# Altium project VoodooMagic.PrjPcb (part 1 of 2)
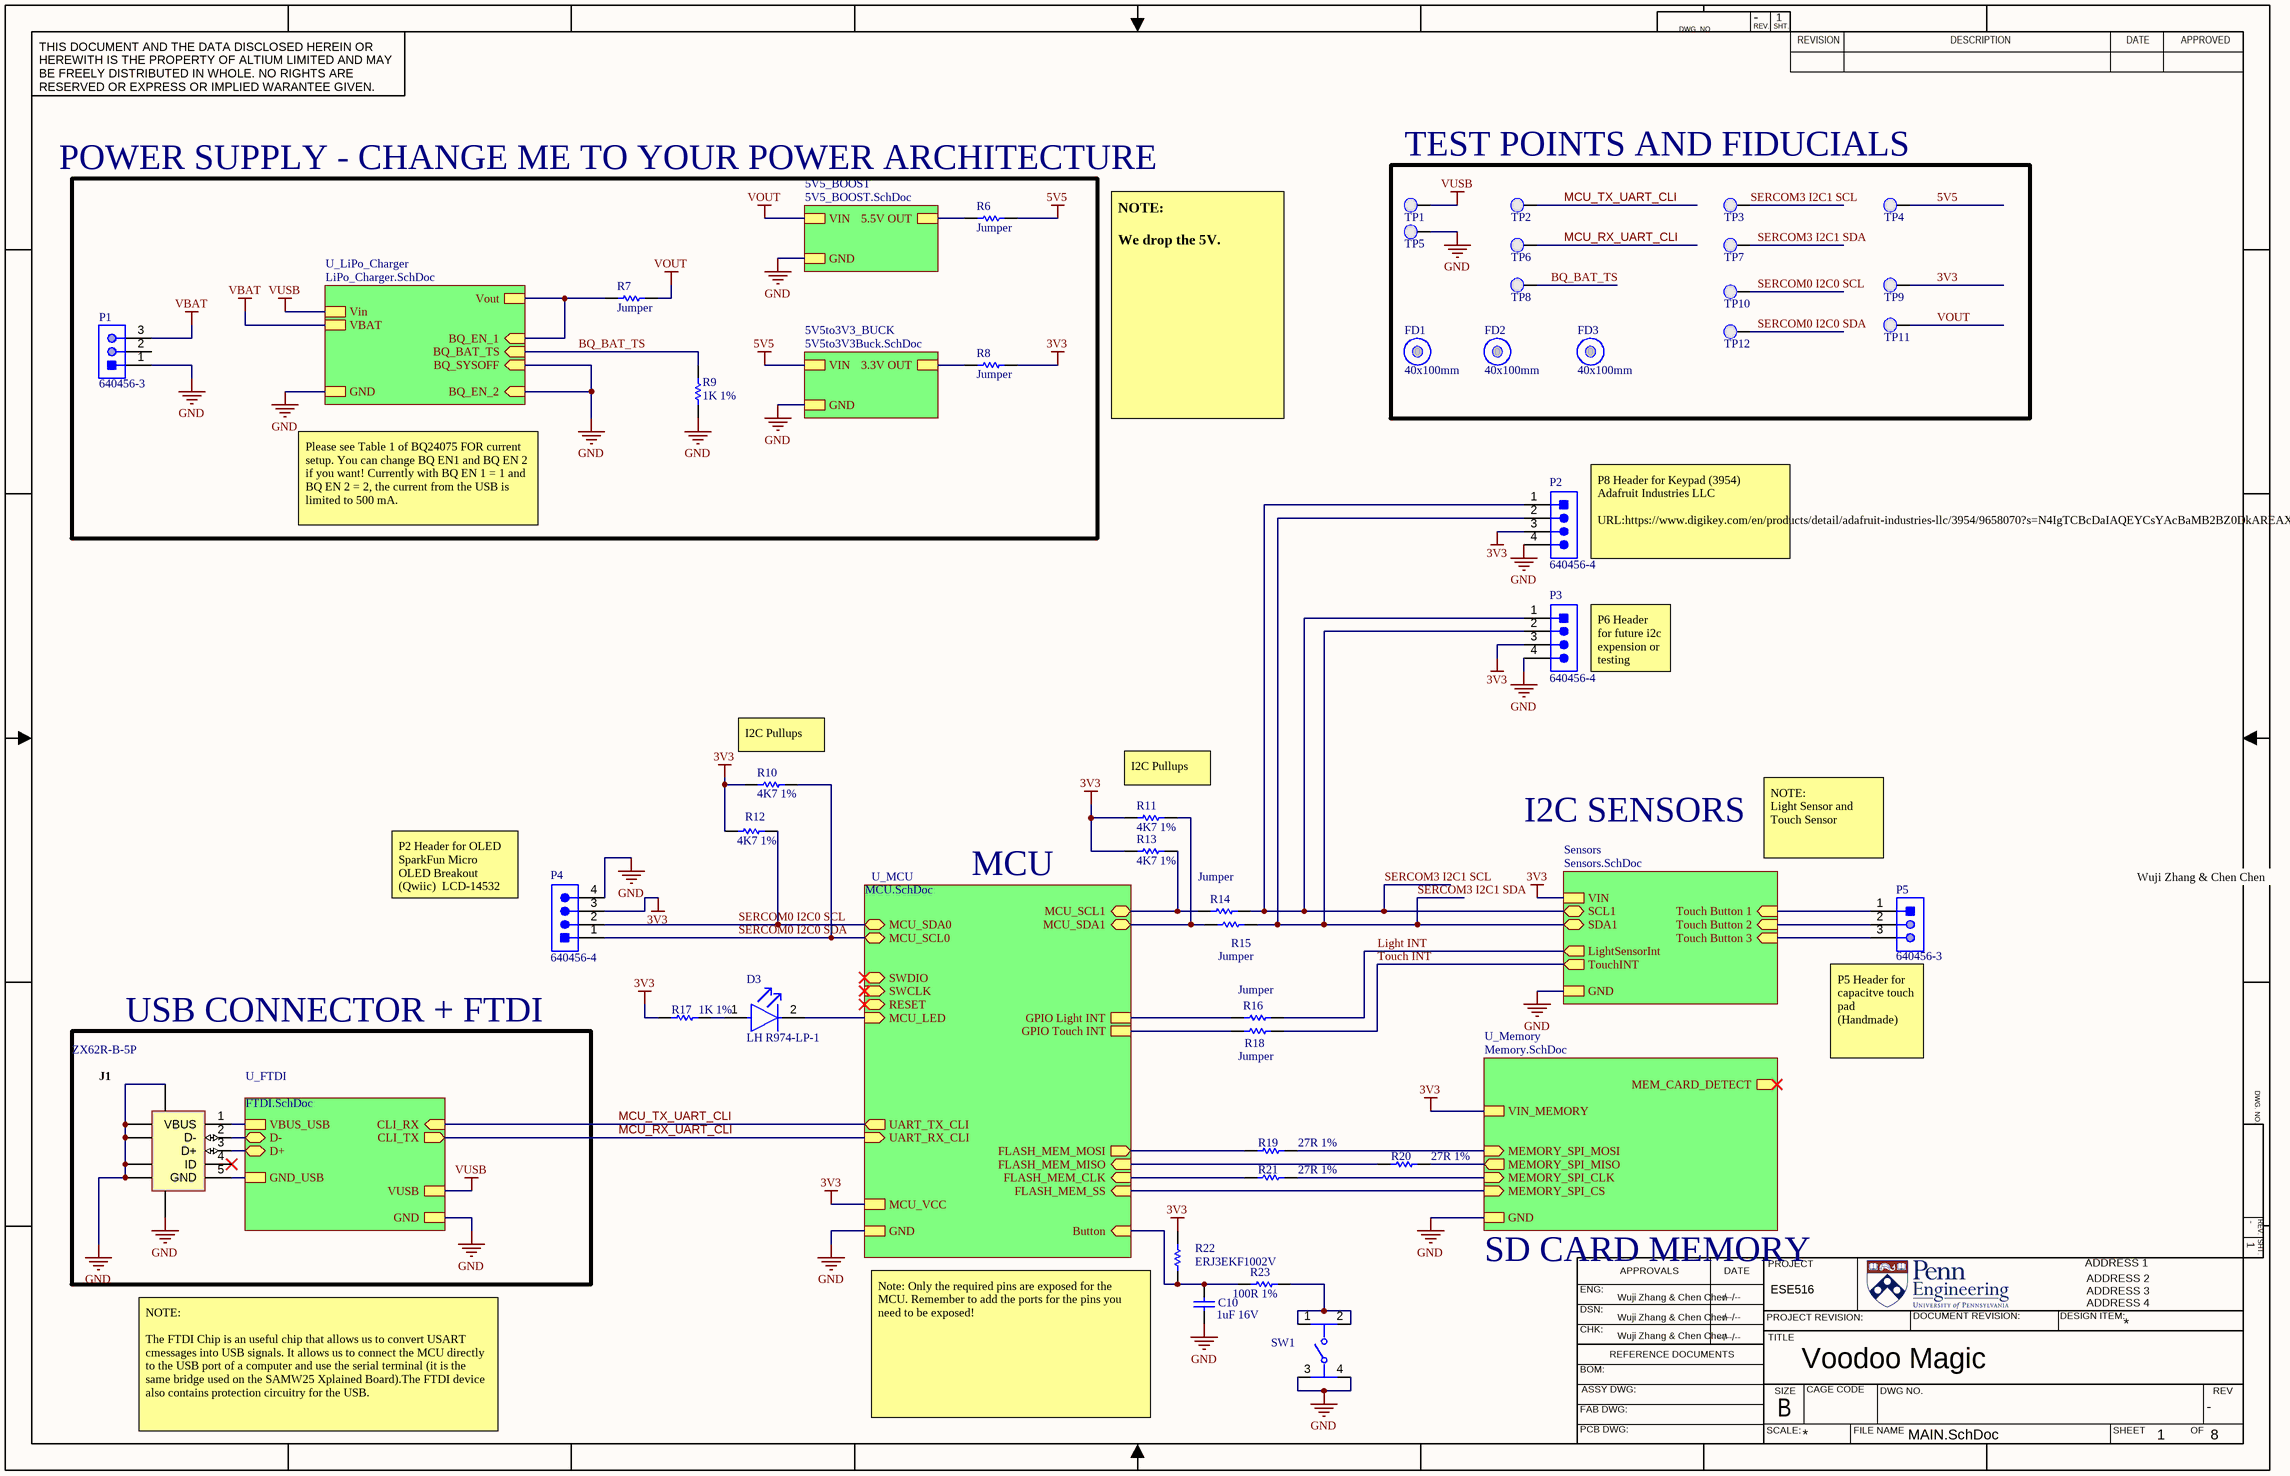
[diagram p0: MAIN.SchDoc]
8 sheets, 132 parts. Net scope: strictly hierarchical (ports join the sheet entries above them; power ports are local).
Board file: ESE516_PCB.PcbDoc
Sheets:
  MAIN.SchDoc
    U_FTDI = FTDI.SchDoc
    U_MCU = MCU.SchDoc
    U_Memory = Memory.SchDoc
    U_LiPo_Charger = LiPo_Charger.SchDoc
    5V5_BOOST = 5V5_BOOST.SchDoc
    5V5to3V3_BUCK = 5V5to3V3Buck.SchDoc
    Sensors = Sensors.SchDoc

## Sheet MAIN.SchDoc: Voodoo Magic
size 431 x 279 mm; CheckedBy: Wuji Zhang & Chen Chen; Author: Wuji Zhang & Chen Chen; CompanyName: Upenn; DrawnBy: Wuji Zhang & Chen Chen; Engineer: Wuji Zhang & Chen Chen; Organization: ORGANIZATION; Address1: ADDRESS 1; Address2: ADDRESS 2; Address3: ADDRESS 3; Address4: ADDRESS 4; Revision: -; SheetNumber: 1; SheetTotal: 8; Title2: Main; Project: ESE516; ENG_APP_DATE: --/--/--; DSN_APP_DATE: --/--/--; CHK_APP_DATE: --/--/--

### Parts
C10  1uF 16V  [CAPC0603(1608)100_N]
D3  LH R974-LP-1  [FP-LH_R974-MFG]
FD1  40x100mm  [Fiducial_FT]
FD2  40x100mm  [Fiducial_FT]
FD3  40x100mm  [Fiducial_FT]
J1  ZX62R-B-5P  [HIRO-ZX62R-B-5P_V]
P1  640456-3  [TECO-640456-3]
P2  640456-4  [TECO-640456-4]
P3  640456-4  [TECO-640456-4]
P4  640456-4  [TECO-640456-4]
P5  640456-3  [TECO-640456-3]
R6  Jumper  [RESC0805(2012)_N]
R7  Jumper  [RESC0805(2012)_N]
R8  Jumper  [RESC0805(2012)_N]
R9  1K 1%  [RESC0603(1608)_N]
R10  4K7 1%  [RESC0402(1005)_N]
R11  4K7 1%  [RESC0402(1005)_N]
R12  4K7 1%  [RESC0402(1005)_N]
R13  4K7 1%  [RESC0402(1005)_N]
R14  Jumper  [RESC0805(2012)_N]
R15  Jumper  [RESC0805(2012)_N]
R16  Jumper  [RESC0805(2012)_N]
R17  1K 1%  [RESC0603(1608)_N]
R18  Jumper  [RESC0805(2012)_N]
R19  27R 1%  [RESC0603(1608)_N]
R20  27R 1%  [RESC0603(1608)_N]
R21  27R 1%  [RESC0603(1608)_N]
R22  ERJ3EKF1002V  [RESC1609X55X30LL15T15]
R23  100R 1%  [RESC0603(1608)_N]
SW1  PTS810 SJG 250 SMTR LFS  [FP-PTS810_SJG_250_SMTR_LF-MFG]  (value not drawn)
TP1  0.1" Pad  [PCBComponent]  (value not drawn)
TP2  0.1" Pad  [PCBComponent]  (value not drawn)
TP3  0.1" Pad  [PCBComponent]  (value not drawn)
TP4  0.1" Pad  [PCBComponent]  (value not drawn)
TP5  0.1" Pad  [PCBComponent]  (value not drawn)
TP6  0.1" Pad  [PCBComponent]  (value not drawn)
TP7  0.1" Pad  [PCBComponent]  (value not drawn)
TP8  0.1" Pad  [PCBComponent]  (value not drawn)
TP9  0.1" Pad  [PCBComponent]  (value not drawn)
TP10  0.1" Pad  [PCBComponent]  (value not drawn)
TP11  0.1" Pad  [PCBComponent]  (value not drawn)
TP12  0.1" Pad  [PCBComponent]  (value not drawn)

### Blocks framed on the sheet
TEST POINTS AND FIDUCIALS: FD1-FD3 TP1-TP12
USB CONNECTOR + FTDI: J1

### Sub-sheets
5V5_BOOST = 5V5_BOOST.SchDoc: VIN, 5.5V OUT, GND
5V5to3V3_BUCK = 5V5to3V3Buck.SchDoc: VIN, 3.3V OUT, GND
Sensors = Sensors.SchDoc: VIN, SCL1 (bidir), SDA1 (bidir), TouchINT (out), LightSensorInt (out), GND, Touch Button 1 (in), Touch Button 2 (in), Touch Button 3 (in)
U_FTDI = FTDI.SchDoc: CLI_RX (in), CLI_TX (out), VUSB, GND, VBUS_USB, D- (bidir), D+ (bidir), GND_USB
U_LiPo_Charger = LiPo_Charger.SchDoc: BQ_EN_2 (in), BQ_SYSOFF (in), BQ_EN_1 (in), BQ_BAT_TS (in), Vin, Vout, GND, VBAT
U_MCU = MCU.SchDoc: SWDIO (bidir), SWCLK (in), UART_TX_CLI (out), UART_RX_CLI (in), FLASH_MEM_SS (in), FLASH_MEM_CLK (in), FLASH_MEM_MISO (in), FLASH_MEM_MOSI (out), RESET (bidir), MCU_LED (in), MCU_VCC, GND, MCU_SCL1 (bidir), MCU_SDA1 (bidir), GPIO Light INT, GPIO Touch INT, Button (in), MCU_SCL0 (bidir), MCU_SDA0 (bidir)
U_Memory = Memory.SchDoc: MEMORY_SPI_MOSI (in), MEMORY_SPI_MISO (out), MEMORY_SPI_CLK (in), MEMORY_SPI_CS (in), MEM_CARD_DETECT (out), VIN_MEMORY, GND

### Nets
3V3: P2.3 P3.3 P4.3 R8.2 R10.2 R11.2 R12.2 R13.2 R17.1 R22.2 TP9.1(PAD) ; sheet U_MCU/MCU_VCC, sheet U_Memory/VIN_MEMORY, sheet Sensors/VIN
5V5: R6.2 TP4.1(PAD) ; sheet 5V5to3V3_BUCK/VIN
GND: C10.1 J1.5(GND) J1.6(SHLD) J1.7(SHLD) J1.8(SHLD) J1.9(SHLD) J1.10(SHLD) J1.11(SHLD) P1.1 P2.4 P3.4 P4.4 R9.2 SW1.3 SW1.4 TP5.1(PAD) ; sheet U_FTDI/GND, sheet U_FTDI/GND_USB, sheet U_MCU/GND, sheet U_Memory/GND, sheet U_LiPo_Charger/BQ_EN_2, sheet U_LiPo_Charger/BQ_SYSOFF, sheet U_LiPo_Charger/GND, sheet 5V5_BOOST/GND, sheet 5V5to3V3_BUCK/GND, sheet Sensors/GND
VBAT: P1.3 ; sheet U_LiPo_Charger/VBAT
VBUS: J1.1(VBUS) ; sheet U_FTDI/VBUS_USB
VOUT: R7.2 TP11.1(PAD) ; sheet 5V5_BOOST/VIN
Vout_BQ: R7.1 ; sheet U_LiPo_Charger/BQ_EN_1, sheet U_LiPo_Charger/Vout
VUSB: TP1.1(PAD) ; sheet U_FTDI/VUSB, sheet U_LiPo_Charger/Vin
3.3V OUT: R8.1 ; sheet 5V5to3V3_BUCK/3.3V OUT
5.5V OUT: R6.1 ; sheet 5V5_BOOST/5.5V OUT
BQ_BAT_TS: R9.1 TP8.1(PAD) ; sheet U_LiPo_Charger/BQ_BAT_TS
Button: C10.2 R22.1 R23.1 ; sheet U_MCU/Button
FLASH_MEM_SPI_SS: sheet U_MCU/FLASH_MEM_SS, sheet U_Memory/MEMORY_SPI_CS
GPIO LIGHT INT: R16.1 ; sheet U_MCU/GPIO Light INT
GPIO Touch INT: R18.1 ; sheet U_MCU/GPIO Touch INT
Light INT: R16.2 ; sheet Sensors/LightSensorInt
MCU_LED: D3.2(C) ; sheet U_MCU/MCU_LED
MCU_RX_UART_CLI: TP6.1(PAD) ; sheet U_FTDI/CLI_TX, sheet U_MCU/UART_RX_CLI
MCU_TX_UART_CLI: TP2.1(PAD) ; sheet U_FTDI/CLI_RX, sheet U_MCU/UART_TX_CLI
MEM_SPI_CLK: R21.2 ; sheet U_Memory/MEMORY_SPI_CLK
MEM_SPI_MISO: R20.2 ; sheet U_Memory/MEMORY_SPI_MISO
MEM_SPI_MOSI: R19.2 ; sheet U_Memory/MEMORY_SPI_MOSI
SERCOM0 I2C0 SCL: P4.2 R12.1 TP10.1(PAD) ; sheet U_MCU/MCU_SDA0
SERCOM0 I2C0 SDA: P4.1 R10.1 TP12.1(PAD) ; sheet U_MCU/MCU_SCL0
SERCOM1_PAD2_SPI_MISO: R20.1 ; sheet U_MCU/FLASH_MEM_MISO
SERCOM1_PAD2_SPI_MOSI: R19.1 ; sheet U_MCU/FLASH_MEM_MOSI
SERCOM1_PAD3_SPI_SCK: R21.1 ; sheet U_MCU/FLASH_MEM_CLK
SERCOM3 I2C1 SCL: P2.1 P3.1 R14.2 TP3.1(PAD) ; sheet Sensors/SCL1
SERCOM3 I2C1 SCL: R13.1 R14.1 ; sheet U_MCU/MCU_SCL1  [a separate net that carries the same name]
SERCOM3 I2C1 SDA: P2.2 P3.2 R15.2 TP7.1(PAD) ; sheet Sensors/SDA1
SERCOM3 I2C1 SDA: R11.1 R15.1 ; sheet U_MCU/MCU_SDA1  [a separate net that carries the same name]
Touch Button 1: P5.1 ; sheet Sensors/Touch Button 1
Touch Button 2: P5.2 ; sheet Sensors/Touch Button 2
Touch Button 3: P5.3 ; sheet Sensors/Touch Button 3
Touch INT: R18.2 ; sheet Sensors/TouchINT
USB_DATA_N: J1.2(D-) ; sheet U_FTDI/D-
USB_DATA_P: J1.3(D+) ; sheet U_FTDI/D+
NetD3_1: D3.1(A) R17.2
NetR23_2: R23.2 SW1.1 SW1.2

Not connected (* = marked no-connect by the designer): J1 4(ID)*; P1 2

### Notes on the sheet
- (near R6) POWER SUPPLY - CHANGE ME TO YOUR POWER ARCHITECTURE
- NOTE:
  We drop the 5V.
- Please see Table 1 of BQ24075 FOR current setup. You can change BQ EN1 and BQ EN 2 if you want! Currently with BQ EN 1 = 1 and BQ EN 2 = 2, the current from the USB is limited to 500 mA.
- (near P2) P8 Header for Keypad (3954) Adafruit Industries LLC
  URL:https://www.digikey.com/en/products/detail/adafruit-industries-llc/3954/9658070?s=N4IgTCBcDaIAQEYCsYAcBaMB2BZ0DkAREAXQF8g
- (near P3) P6 Header for future i2c expension or testing
- (near R10) I2C Pullups
- (near R11) I2C Pullups
- I2C SENSORS
- P2 Header for OLED
  SparkFun Micro OLED Breakout (Qwiic)  LCD-14532
- MCU
- NOTE:
  Light Sensor and Touch Sensor
- Wuji Zhang & Chen Chen
- (near P5) P5 Header for capacitve touch pad (Handmade)
- SD CARD MEMORY
- NOTE:
  The FTDI Chip is an useful chip that allows us to convert USART cmessages into USB signals. It allows us to connect the MCU directly to the USB port of a computer and use the serial terminal (it is the same bridge used on the SAMW25 Xplained Board).The FTDI device also contains protection circuitry for the USB.
- (near R22) Note: Only the required pins are exposed for the MCU. Remember to add the ports for the pins you need to be exposed!
- DWG. NO.
- REV.
- SHT.
- THIS DOCUMENT AND THE DATA DISCLOSED HEREIN OR HEREWITH IS THE PROPERTY OF ALTIUM LIMITED AND MAY BE FREELY DISTRIBUTED IN WHOLE. NO RIGHTS ARE RESERVED OR EXPRESS OR IMPLIED WARANTEE GIVEN.
- REVISION
- DESCRIPTION
- DATE
- APPROVED
- ENG:
- APPROVALS
- PROJECT
- DSN:
- CHK:
- REFERENCE DOCUMENTS
- PROJECT REVISION:
- TITLE
- DOCUMENT REVISION:
- DESIGN ITEM:
- BOM:
- FAB DWG:
- PCB DWG:
- ASSY DWG:
- SCALE:
- SIZE
- B
- CAGE CODE
- FILE NAME
- DWG NO.
- SHEET
- OF
- REV

### Library data of the parts
C10 = CMP-1035-02736-1: CAP 1uF 16V ±5% 0603 (1608 Metric) Thickness 1mm SMD; Case-Metric: 1608; Case-EIA: 0603; Tolerance: Â±5%; Technology: SMT; Max Thickness: 1 mm; Rated Voltage: 16 V; Value: 1uF
D3 = CMP-2000-06540-2: LED RED DIFFUSED 0805 SMD; Number of Elements: 1; Forward Voltage: 2.6V; Viewing Angle: 160°; Reverse Voltage: 5V; Test Current: 20mA; Dominant Wavelength: 645nm; Forward Current: 30mA; Luminous Intensity: 15mcd; Depth: 1.35mm; Min Operating Temperature: -30°C; Length: 2.1mm; Max Operating Temperature: 85°C; Radiation Hardening: No; Packaging: Tape and Reel; Number of Pins: 2; Mount: Surface Mount; Lens Style: Diffused
FD1-FD3 = CMP-00174-A.4: Fiducial 40x100mm
J1 = CMP-0031-00001-1: Connector; USBMicro-B,Reverse type, SMT; 5 Position; Right Angle; DatasheetVersion: 08/2010; Operating Temperature: -30 to 85 degC; Mounting Technology: Surface Mount; PartNumber: ZX62R-B-5P; PackageReference: ZX62R-B-5P; ComponentLink2URL: http://www.hirose.co.jp/cataloge_hp/e24200011.pdf; ComponentLink1URL: http://www.hirose.com/â€Ž; ComponentLink2Description: Datasheet; PackageDescription: 5-Pin USB Micro-B R/A Connector; ComponentLink1Description: Manufacturer URL
P1 P5 = CMP-2000-05418-1: Male Header, Pitch 2.54 mm, 1 x 3 Position, Height 10.03 mm, Tail Length 3.56 mm, -55 to 105 degC; Manufacturer: TE Connectivity; Agency Approvals: CSA,UL; Angle: Straight; Number of Positions: 3; Standards: RoHSCompliant,ELVCompliant,UL94V-0; Current, Rating: 5 / A; Connector Type: MTA-100; Mount Angle: Vertical; Material, Housing: Polyester; Temperature, Operating: -55to+105 / degC; Voltage, Rating: 250 / V; Color, Housing: White; Contact Centerline Spacing: 0.100 / in.; Special Features: Pinstrip; Material, Contact: CopperAlloy; Contact Termination Area Plating: Tin; Primary Type: InterconnectSystem; Pin Spacing: 0.1 / "; Brand/Series: MTA-100Series; Mounting Hole Size: 0.04 / "; Manufacturer URL: http://www.te.com/; Datasheet URL: https://datasheet.ciiva.com/16456/eng-ds-82056-mta-0608-16456886.pdf; Flammability Rating: UL94V-0; Mounting Type: PCMount; Contact Mating Area Plating: Tin; Datasheet Version: Jun-08; Number of Rows: 1; Termination: Solder; Type: PCBPlug; Length, Pin: 0.14 / "; Color: White; Contact Plating: Tin; Contact Shape: Square; Number of Contacts: 3; Size, Post: 0.025 / in.; Length, Terminal Post: 0.14 / in.; Length, Overall: 0.3 / "
P2-P4 = CMP-2000-05419-1: Male Header, Pitch 2.54 mm, 1 x 4 Position, Height 10.03 mm, Tail Length 3.56 mm, RoHS, Bulk; Manufacturer: TE Connectivity; Material, Housing: Polyester; Primary Type: InterconnectSystem; Mount Angle: Vertical; Color, Housing: White; Current, Rating: 5 / A; Agency Approvals: CSA,UL; Contact Termination Area Plating: Tin; Temperature, Operating: -55to+105 / degC; Standards: RoHSCompliant,ELVCompliant,UL94V-0; Number of Positions: 4; Brand/Series: MTA-100Series; Angle: Straight; Pin Spacing: 0.1 / "; Material, Contact: CopperAlloy; Connector Type: MTA-100; Special Features: Pinstrip; Mounting Hole Size: 0.04 / "; Contact Centerline Spacing: 0.100 / in.; Voltage, Rating: 250 / V; Manufacturer URL: http://www.te.com/; Length, Pin: 0.14 / "; Length, Overall: 0.4 / "; Color: White; Flammability Rating: UL94V-0; Mounting Type: PCMount; Termination: Solder; Datasheet URL: https://datasheet.ciiva.com/16286/eng-ds-82056-mta-0608-16286228.pdf; Number of Contacts: 4; Contact Shape: Square; Contact Mating Area Plating: Tin; Length, Terminal Post: 0.14 / in.; Size, Post: 0.025 / in.; Contact Plating: Tin; Type: PCBPlug; Datasheet Version: Dec-14; Number of Rows: 1
R6-R8 R14-R16 R18 = CMP-1013-00001-1: Jumper 0805 (2012 Metric); Case-EIA: 0805; Value: 0.00 Ohm; Tolerance: None; Case-Metric: 2012; Technology: SMT; Power: None
R9 R17 = CMP-1012-00510-1: 1K 0.1W 1% 0603 (1608 Metric)  SMD; Case-Metric: 1608; Case-EIA: 0603; Value: 1000.00 Ohm; Technology: SMT; Tolerance: 1 %; Power: 0.1 W
R10-R13 = CMP-1011-00586-1: 4K7 0.063W 1% 0402 (1005 Metric)  SMD; Case-Metric: 1005; Value: 4700.00 Ohm; Case-EIA: 0402; Power: 0.063 W; Technology: SMT; Tolerance: 1 %
R19-R21 = CMP-1012-00331-1: 27R 0.1W 1% 0603 (1608 Metric)  SMD; Case-EIA: 0603; Value: 27.00 Ohm; Case-Metric: 1608; Technology: SMT; Tolerance: 1 %; Power: 0.1 W
R22 = CMP-1012-00623-3: Chip Resistor, 10 KOhm, +/- 1%, 0.1 W, -55 to 155 degC, 0603 (1608 Metric), RoHS, Tape and Reel; Manufacturer: Panasonic; Case\/Package: 0603; Max Power Dissipation: 100mW; Resistance: 10KOhm; Temperature Coefficient: 100ppm\/degreesC; Voltage Rating (DC): 75V; Tolerance: 1%; Case Code (Imperial): 0603; Case Code (Metric): 1608; Composition: ThickFilm; Contact Plating: Tin; Datasheet URL: https://industrial.panasonic.com/cdbs/www-data/pdf/RDA0000/AOA0000C304.pdf; Datasheet Version: 02/2017; Depth: 0.8mm; Height: 0.45mm; Lead Free: LeadFree; Length: 1.6mm; Manufacturer URL: http://www.panasonic.com/; Max Operating Temperature: 155degC; Military Standard: Not; Min Operating Temperature: -55degC; Mount: SurfaceMount; Mounting Technology: SurfaceMount; Number of Pins: 2; Number of Terminations: 2; Package Description: 2-Pin Surface Mount Device, Body 1.6 x 0.85 mm; Package Quantity: 1; Package Reference: 603; Packaging: TapeandReel; Power Rating: 100mW; Radiation Hardening: No; REACH SVHC: NoSVHC; RoHSCompliant: true; Termination: SMD/SMT; Voltage Rating: 75V; Width: 0.031inch
R23 = CMP-1012-00397-1: 100R 0.1W 1% 0603 (1608 Metric)  SMD; Value: 100.00 Ohm; Case-EIA: 0603; Case-Metric: 1608; Technology: SMT; Tolerance: 1 %; Power: 0.1 W
SW1 = CMP-10040-000011-1: SWITCH TACTILE SPST-NO 0.05A 16V; Manufacturer: C&K Components; Electromechanical Life: 100000Cycles; Contact Resistance: 500mΩ; Operating Force: 400gf; Current Rating: 50mA; Voltage Rating Dc: 16V; Device Class L2: Switches; Device Class L1: Electromechanical; ComponentLink2URL: https://www.ckswitches.com/media/1476/pts810.pdf; Digikey Description: SWITCH TACTILE SPST-NO 0.05A 16V; RoHS: TRUE; Temperature Range Low: -40°C; Temperature Range High: +85°C; Automotive: No; Category: Switch; ComponentLink2Description: Datasheet; Device Class L3: Tactile Switches; Mouser Description: Switch Tactile N.O. SPST Button J-Bend 0.05A 16VDC 100000Cycles 3.92N SMD T/R; Throw Configuration: SPST-NO; Package: PTS810 SJG 250 SMTR LFS; Height: 2.7mm; Octopart: https://octopart.com/pts810sjg250smtrlfs-c%26k+components-29380277; Manufacturer Part Number: PTS810 SJG 250 SMTR LFS; Temperature: -40°C to +85°C; Lead Free: Yes
TP1-TP12 = 0.1" Pad-A.4

## Sheet FTDI.SchDoc: FTDI
size 431 x 279 mm; ApprovedBy: Wuji Zhang; CheckedBy: Wuji Zhang; Author: Wuji Zhang; CompanyName: Upenn; DrawnBy: Wuji Zhang; Engineer: Wuji Zhang; Organization: Upenn; Address1: ADDRESS 1; Address2: ADDRESS 2; Address3: ADDRESS 3; Address4: ADDRESS 4; Revision: -; SheetNumber: 6; SheetTotal: 8; ENG_APP_DATE: --/--/--; DSN_APP_DATE: --/--/--; CHK_APP_DATE: --/--/--
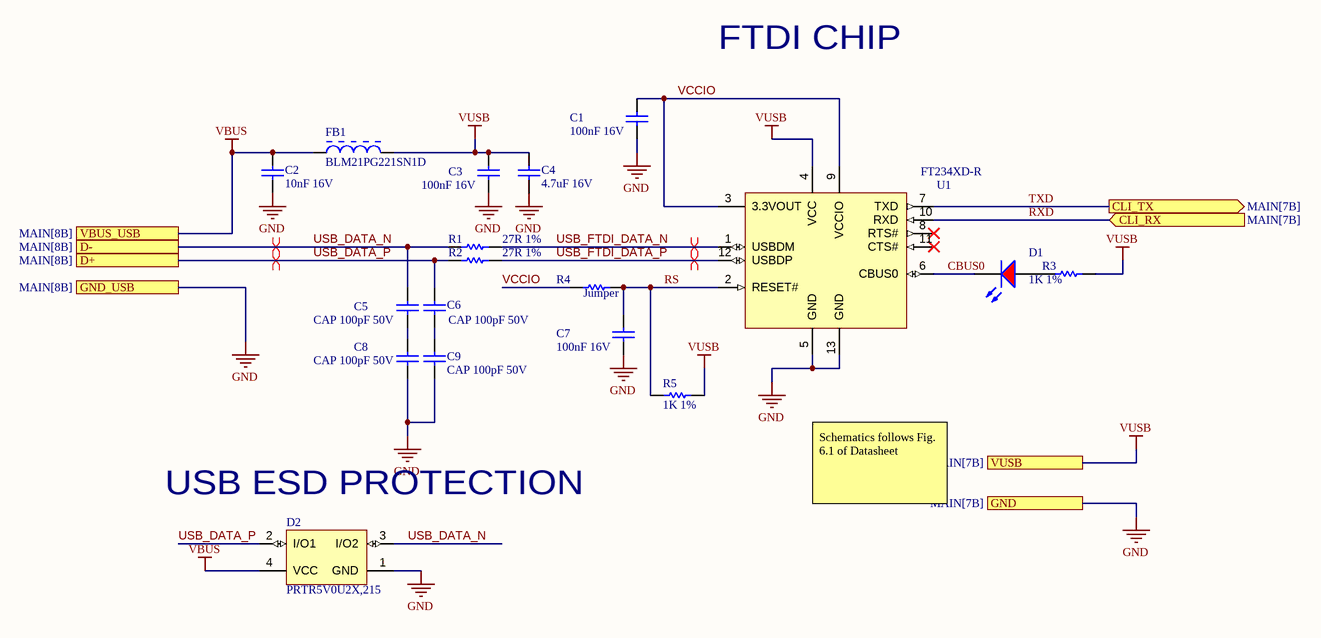
[diagram p1: FTDI.SchDoc]

### Parts
C1  100nF 16V  [CAPC0603(1608)100_N]
C2  10nF 16V  [CAPC0603(1608)100_N]
C3  100nF 16V  [CAPC0603(1608)100_N]
C4  4.7uF 16V  [CAPC0805(2012)145_N]
C5  CAP 100pF 50V  [CAPC0603(1608)100_L]
C6  CAP 100pF 50V  [CAPC0603(1608)100_L]
C7  100nF 16V  [CAPC0603(1608)100_N]
C8  CAP 100pF 50V  [CAPC0603(1608)100_L]
C9  CAP 100pF 50V  [CAPC0603(1608)100_L]
D1  LTST-C170CKT  [LTST-C170CKT_V]  (value not drawn)
D2  PRTR5V0U2X,215  [NXP-SOT143B-4_V]
FB1  BLM21PG221SN1D  [MURA-BLM21-B20-CHIP-2_V2]
R1  27R 1%  [RESC0603(1608)_N]
R2  27R 1%  [RESC0603(1608)_N]
R3  1K 1%  [RESC0603(1608)_N]
R4  Jumper  [RESC0603(1608)_N]
R5  1K 1%  [RESC0603(1608)_N]
U1  FT234XD-R  [DFN-12_V]

### Ports
CLI_RX (in, see MAIN[7B]), CLI_TX (out, see MAIN[7B]), D+ (see MAIN[8B]), D- (see MAIN[8B]), GND (see MAIN[7B]), GND_USB (see MAIN[8B]), VBUS_USB (see MAIN[8B]), VUSB (see MAIN[7B])

### Nets
GND: C1.1 C2.1 C3.1 C4.1 C7.1 C8.1 C9.1 D2.1(GND) U1.5(GND) U1.13(GND) ; port GND, port GND_USB
VBUS: C2.2 D2.4(VCC) FB1.1 ; port VBUS_USB
VUSB: C3.2 C4.2 FB1.2 R3.2 R5.1 U1.4(VCC) ; port VUSB
CBUS0: D1.2(K) U1.6(CBUS0)  [project net CBUS0_6]
RS: C7.2 R4.2 R5.2 U1.2(RESET#)  [project net RS_6]
RXD: U1.10(RXD) ; port CLI_RX  [project net MCU_TX_UART_CLI]
TXD: U1.7(TXD) ; port CLI_TX  [project net MCU_RX_UART_CLI]
USB_DATA_N: C5.2 D2.3(I/O2) R1.1 ; port D-
USB_DATA_P: C6.2 D2.2(I/O1) R2.1 ; port D+
USB_FTDI_DATA_N: R1.2 U1.1(USBDM)  [project net USB_FTDI_DATA_N_6]
USB_FTDI_DATA_P: R2.2 U1.12(USBDP)  [project net USB_FTDI_DATA_P_6]
VCCIO: C1.2 R4.1 U1.3(3.3VOUT) U1.9(VCCIO)  [project net VCCIO_6]
NetC5_1: C5.1 C8.2
NetC6_1: C6.1 C9.2
NetD1_1: D1.1(A) R3.1

Not connected (* = marked no-connect by the designer): U1 8(RTS#)* 11(CTS#)*

### Layout directives
differential pair: USB_DATA_N, USB_DATA_P, USB_FTDI_DATA_N_6, USB_FTDI_DATA_P_6

### Notes on the sheet
- FTDI CHIP
- (near D2) USB ESD PROTECTION
- Schematics follows Fig. 6.1 of Datasheet
- DWG. NO.
- REV.
- SHT.
- THIS DOCUMENT AND THE DATA DISCLOSED HEREIN OR HEREWITH IS THE PROPERTY OF ALTIUM LIMITED AND MAY BE FREELY DISTRIBUTED IN WHOLE. NO RIGHTS ARE RESERVED OR EXPRESS OR IMPLIED WARANTEE GIVEN.
- REVISION
- DESCRIPTION
- DATE
- APPROVED
- ENG:
- APPROVALS
- PROJECT
- DSN:
- CHK:
- REFERENCE DOCUMENTS
- PROJECT REVISION:
- TITLE
- DOCUMENT REVISION:
- DESIGN ITEM:
- BOM:
- FAB DWG:
- PCB DWG:
- ASSY DWG:
- SCALE:
- SIZE
- B
- CAGE CODE
- FILE NAME
- DWG NO.
- SHEET
- OF
- REV

### Library data of the parts
C1 C3 C7 = CMP-1035-02584-1: CAP 100nF 16V ±10% 0603 (1608 Metric) Thickness 1mm SMD; Tolerance: Â±10%; Case-EIA: 0603; Case-Metric: 1608; Technology: SMT; Max Thickness: 1 mm; Value: 100nF; Rated Voltage: 16 V
C2 = CMP-1035-02311-1: CAP 10nF 16V ±10% 0603 (1608 Metric) Thickness 1mm SMD; Case-EIA: 0603; Case-Metric: 1608; Tolerance: Â±10%; Rated Voltage: 16 V; Value: 10nF; Max Thickness: 1 mm; Technology: SMT
C4 = CMP-1036-04893-1: CAP 4.7uF 16V -20% to +80% 0805 (2012 Metric) Thickness 1.45mm SMD; Case-Metric: 2012; Case-EIA: 0805; Max Thickness: 1.45 mm; Value: 4.7uF; Rated Voltage: 16 V; Tolerance: -20% to +80%; Technology: SMT
C5 C6 C8 C9 = CMP-1035-01271-1: CAP 100pF 50V ±20% 0603 (1608 Metric) Thickness 1mm SMD; Case-Metric: 1608; Tolerance: Â±20%; Case-EIA: 0603; Max Thickness: 1 mm; Technology: SMT; Value: 100pF; Rated Voltage: 50 V
D1 = CMP-1674-00001-5: LED Uni-Color Red, 100 mW, 200 mA, -55 to 85 degC, 2-Pin SMD, RoHS, Tape and Reel; Manufacturer: Lite-On; PackageReference: C170CKT; ComponentLink1Description: Manufacturer URL; ComponentLink1URL: http://www.us.liteon.com/; Package Quantity: 3000; Packaging: Tape and Reel; Pins: 2; ComponentLink2URL: http://media.digikey.com/pdf/Data%20Sheets/Lite-On%20PDFs/LTST-C170CKT.pdf; Max Operating Temperature: 85 degC; Min Operating Temperature: -55 degC; Mounting Technology: Surface Mount; Mount: Surface Mount; Length: 2 mm; ComponentLink2Description: Datasheet; DatasheetVersion: 03/2003; Height: 1.1 mm; PackageDescription: 2-Pin Surface Mount Device, Body 2 x 1.25 mm; RoHSCompliant: true; Colour: Red
D2 = CMP-2000-05285-1: Ultra Low Capacitance Double Rail-to-Rail ESD Protection Diode, 5.5 V, 1 pF, -40 to 85 degC, 4-Pin SOT143B, RoHS, Tape and Reel; Manufacturer: NXP Semiconductors; Capacitance Value: 16pF; Number of Elements: 1; Rad Hardened: No; Reverse Breakdown Voltage: 6V; Working Voltage (Max): 5.5V; Polarity: Uni-Directional; Configuration: Quad; Leakage Current: 0.1uA; Product Height (mm): 1mm; Suppressor Type: DiodeArrays; Product Length (mm): 3mm; Product Depth (mm): 1.4mm; ESD Protection Voltage: 8KV@ContactDisc; Package Type: SOT; Mounting: SurfaceMount; Packaging: TapeandReel; Datasheet Version: Rev. 02, 01/2008; Reverse Stand-off Voltage: 5.5V; Manufacturer URL: http://www.nxp.com/; Operating Temp Range: -40Cto85C; Operating Temperature Classification: Industrial; Working Voltage: 5.5V; Operating Temperature Min Deg. C: -40C; Datasheet URL: https://datasheet.ciiva.com/4479/prtr5v0u2x-102853-4479461.pdf; Leakage Current (Max): 0.1uA; Direction Type: Uni-Directional; Pin Count: 3+Tab; Operating Temperature Max Deg. C: 85C; Mounting Style: SurfaceMount; Package / Case: SOT
FB1 = CMP-0686-00610-2: Chip Ferrite Bead for Power Lines, 220 Ohm, 2000 mA, -55 to 125 degC, 2 x 1.25 x 1.05 mm SMD, Tape and Reel; Manufacturer: Murata; DC Resistance: 0.045 Ohm Max.; Impedance (at 100 MHz): 220 Ohm +/- 25%; Rated Current: 2000 mA; PartNumber: BLM21PG221SN1D; Mounting Technology: Surface Mount; DatasheetVersion: 08/2013; ComponentLink3URL: http://www.murata.com/products/catalog/pdf/c31e.pdf; ComponentLink1URL: http://www.murata.com/; ComponentLink1Description: Manufacturer URL; ComponentLink2URL: http://www.murata.com/products/catalog/pdf/c31e.pdf; PackageDescription: 2-Pin Chip, Body 2 x 1.25 mm; ComponentLink3Description: Package Specification; Operating Temperature Range: -55 to 125 degC; Packing: Tape and Reel; ComponentLink2Description: Datasheet; PackageReference: BLM21_H1050-2
R1 R2 = CMP-1012-00331-1: as R19 on sheet MAIN; Technology: SMT; Tolerance: 1 %; Power: 0.1 W
R3 R5 = CMP-1012-00510-1: as R9 on sheet MAIN; Technology: SMT; Tolerance: 1 %; Power: 0.1 W
R4 = CMP-1012-00001-1: Jumper 0603 (1608 Metric); Case-Metric: 1608; Value: 0.00 Ohm; Power: None; Case-EIA: 0603; Technology: SMT; Tolerance: None
U1 = CMP-0248-00027-1: FT234XD USB to BASIC UART IC, -40 to +85 degC, 12-Pin DFN, Pb-Free, Tape and Reel; Manufacturer: FTDI; PackageReference: DFN-12; PackageVersion: Feb-13; DatasheetVersion: ver 1.1, Feb-2013; ComponentLink1URL: http://www.ftdichip.com/; PartNumber: FT234XD-R; ComponentLink2URL: http://www.ftdichip.com/Support/Documents/DataSheets/ICs/DS_FT234XD.pdf; ComponentLink1Description: Manufacturer URL; PackageDescription: 12-Pin Dual Flat No-Lead, 3 x 3 mm Body, 0.45 mm Pitch, Exposed Pad; ComponentLink2Description: Datasheet

## Sheet MCU.SchDoc: MCU
size 431 x 279 mm; Organization: ORGANIZATION; Address1: ADDRESS 1; Address2: ADDRESS 2; Address3: ADDRESS 3; Address4: ADDRESS 4; Revision: -; SheetNumber: 5; SheetTotal: 9; ENG_APP_DATE: --/--/--; DSN_APP_DATE: --/--/--; CHK_APP_DATE: --/--/--
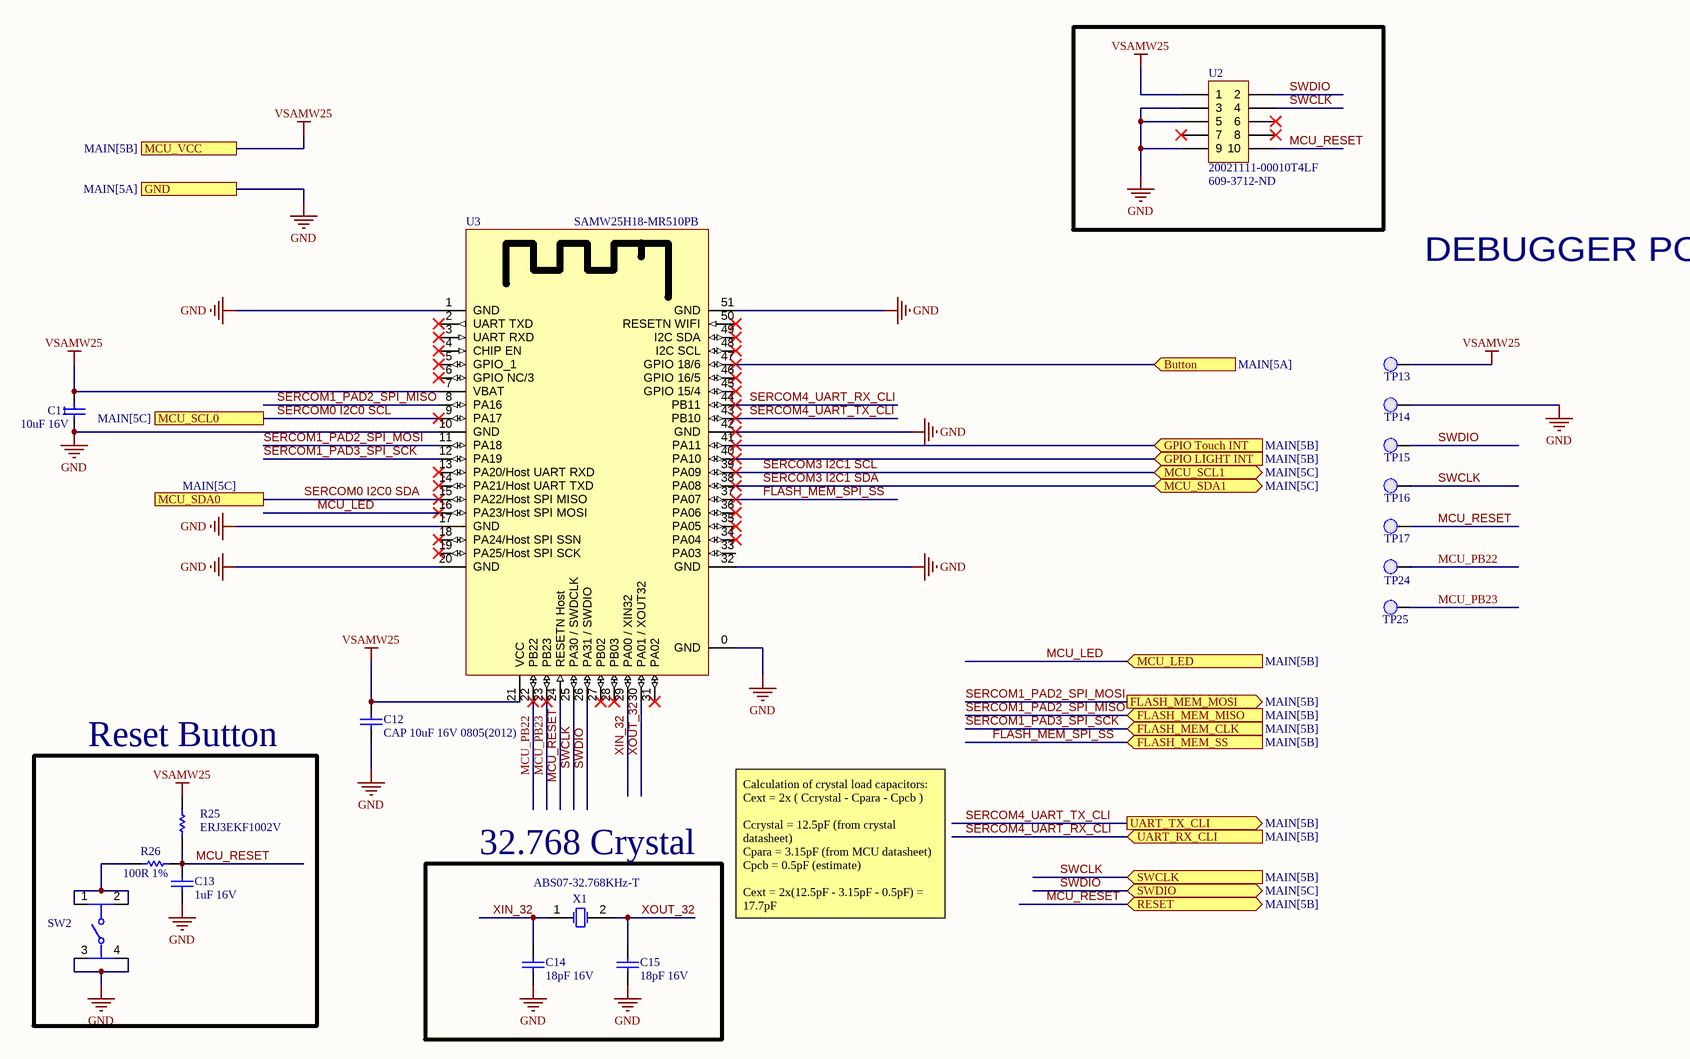
[diagram p2: MCU.SchDoc]

### Parts
C11  10uF 16V  [CAPC0805(2012)145_N]
C12  CAP 10uF 16V 0805(2012)  [CAPC0805(2012)145_N]
C13  1uF 16V  [CAPC0603(1608)100_N]
C14  18pF 16V  [CAPC0603(1608)100_N]
C15  18pF 16V  [CAPC0603(1608)100_N]
R25  ERJ3EKF1002V  [RESC1609X55X30LL15T15]
R26  100R 1%  [RESC0603(1608)_N]
SW2  PTS810 SJG 250 SMTR LFS  [FP-PTS810_SJG_250_SMTR_LF-MFG]  (value not drawn)
TP13  0.1" Pad  [PCBComponent]  (value not drawn)
TP14  0.1" Pad  [PCBComponent]  (value not drawn)
TP15  0.1" Pad  [PCBComponent]  (value not drawn)
TP16  0.1" Pad  [PCBComponent]  (value not drawn)
TP17  0.1" Pad  [PCBComponent]  (value not drawn)
TP24  0.1" Pad  [PCBComponent]  (value not drawn)
TP25  0.1" Pad  [PCBComponent]  (value not drawn)
U2  20021111-00010T4LF  Supplier Part Number 1: 609-3712-ND  [20021111-00010T4LF]
U3  SAMW25H18-MR510PB  [SAMW25H18-MR510PB]
X1  ABS07-32.768KHz-T  [ABRA-ABS07-2_V]

### Blocks framed on the sheet
Reset Button: C13 R25 R26 SW2
32.768 Crystal: C14 C15 X1

### Ports
Button (in, see MAIN[5A]), FLASH_MEM_CLK (in, see MAIN[5B]), FLASH_MEM_MISO (in, see MAIN[5B]), FLASH_MEM_MOSI (out, see MAIN[5B]), FLASH_MEM_SS (in, see MAIN[5B]), GND (see MAIN[5A]), GPIO LIGHT INT (in, see MAIN[5B]), GPIO Touch INT (in, see MAIN[5B]), MCU_LED (in, see MAIN[5B]), MCU_SCL0 (see MAIN[5C]), MCU_SCL1 (bidir, see MAIN[5C]), MCU_SDA0 (see MAIN[5C]), MCU_SDA1 (bidir, see MAIN[5C]), MCU_VCC (see MAIN[5B]), RESET (bidir, see MAIN[5B]), SWCLK (in, see MAIN[5B]), SWDIO (bidir, see MAIN[5C]), UART_RX_CLI (in, see MAIN[5B]), UART_TX_CLI (out, see MAIN[5B])

### Nets
GND: C11.1 C12.1 C13.1 C14.1 C15.1 SW2.3 SW2.4 TP14.1(PAD) U2.3 U2.5 U2.9 U3.0(GND) U3.1(GND) U3.10(GND) U3.17(GND) U3.20(GND) U3.32(GND) U3.42(GND) U3.51(GND) ; port GND
VSAMW25: C11.2 C12.2 R25.2 TP13.1(PAD) U2.1 U3.7(VBAT) U3.21(VCC) ; port MCU_VCC  [project net 3V3]
Button: U3.47(GPIO_18/6) ; port Button
FLASH_MEM_SPI_SS: U3.37(PA07) ; port FLASH_MEM_SS
GPIO LIGHT INT: U3.40(PA10) ; port GPIO LIGHT INT
GPIO Touch INT: U3.41(PA11) ; port GPIO Touch INT
MCU_LED: U3.16(PA23/Host_SPI_MOSI) ; port MCU_LED
MCU_PB22: TP24.1(PAD) U3.22(PB22)  [project net MCU_PB22_5]
MCU_PB23: TP25.1(PAD) U3.23(PB23)  [project net MCU_PB23_5]
MCU_RESET: C13.2 R25.1 R26.2 TP17.1(PAD) U2.10 U3.24(RESETN_Host) ; port RESET
SERCOM0 I2C0 SCL: U3.9(PA17) ; port MCU_SCL0  [project net SERCOM0 I2C0 SDA]
SERCOM0 I2C0 SDA: U3.15(PA22/Host_SPI_MISO) ; port MCU_SDA0  [project net SERCOM0 I2C0 SCL]
SERCOM1_PAD2_SPI_MISO: U3.8(PA16) ; port FLASH_MEM_MISO
SERCOM1_PAD2_SPI_MOSI: U3.11(PA18) ; port FLASH_MEM_MOSI
SERCOM1_PAD3_SPI_SCK: U3.12(PA19) ; port FLASH_MEM_CLK
SERCOM3 I2C1 SCL: U3.39(PA09) ; port MCU_SCL1
SERCOM3 I2C1 SDA: U3.38(PA08) ; port MCU_SDA1
SERCOM4_UART_RX_CLI: U3.44(PB11) ; port UART_RX_CLI  [project net MCU_RX_UART_CLI]
SERCOM4_UART_TX_CLI: U3.43(PB10) ; port UART_TX_CLI  [project net MCU_TX_UART_CLI]
SWCLK: TP16.1(PAD) U2.4 U3.25(PA30_/_SWDCLK) ; port SWCLK
SWDIO: TP15.1(PAD) U2.2 U3.26(PA31_/_SWDIO) ; port SWDIO
XIN_32: C14.2 U3.29(PA00_/_XIN32) X1.1(X1)  [project net XIN_32_5]
XOUT_32: C15.2 U3.30(PA01_/_XOUT32) X1.2(X2)  [project net XOUT_32_5]
NetR26_1: R26.1 SW2.1 SW2.2

Not connected (* = marked no-connect by the designer): U2 6* 7* 8*; U3 2(UART_TXD)* 3(UART_RXD)* 4(CHIP_EN)* 5(GPIO_1)* 6(GPIO_NC/3)* 13(PA20/Host_UART_RXD)* 14(PA21/Host_UART_TXD)* 18(PA24/Host_SPI_SSN)* 19(PA25/Host_SPI_SCK)* 27(PB02)* 28(PB03)* 31(PA02)* 33(PA03) 34(PA04)* 35(PA05)* 36(PA06)* 45(GPIO_15/4)* 46(GPIO_16/5)* 48(I2C_SCL)* 49(I2C_SDA)* 50(RESETN_WIFI)*

### Notes on the sheet
- DEBUGGER PORT
- Calculation of crystal load capacitors:
  Cext = 2x ( Ccrystal - Cpara - Cpcb )
  Ccrystal = 12.5pF (from crystal datasheet)
  Cpara = 3.15pF (from MCU datasheet)
  Cpcb = 0.5pF (estimate)
  Cext = 2x(12.5pF - 3.15pF - 0.5pF) = 17.7pF
- DWG. NO.
- REV.
- SHT.
- THIS DOCUMENT AND THE DATA DISCLOSED HEREIN OR HEREWITH IS THE PROPERTY OF ALTIUM LIMITED AND MAY BE FREELY DISTRIBUTED IN WHOLE. NO RIGHTS ARE RESERVED OR EXPRESS OR IMPLIED WARANTEE GIVEN.
- REVISION
- DESCRIPTION
- DATE
- APPROVED
- ENG:
- APPROVALS
- PROJECT
- DSN:
- CHK:
- REFERENCE DOCUMENTS
- PROJECT REVISION:
- TITLE
- DOCUMENT REVISION:
- DESIGN ITEM:
- BOM:
- FAB DWG:
- PCB DWG:
- ASSY DWG:
- SCALE:
- SIZE
- B
- CAGE CODE
- FILE NAME
- DWG NO.
- SHEET
- OF
- REV

### Library data of the parts
C11 C12 = CMP-1036-04927-1: CAP 10uF 16V ±10% 0805 (2012 Metric) Thickness 1.45mm SMD; Case-EIA: 0805; Tolerance: Â±10%; Case-Metric: 2012; Rated Voltage: 16 V; Technology: SMT; Value: 10uF; Max Thickness: 1.45 mm
C13 = CMP-1035-02736-1: as C10 on sheet MAIN; Technology: SMT; Max Thickness: 1 mm; Rated Voltage: 16 V; Value: 1uF
C14 C15 = CMP-1035-00738-1: CAP 18pF 16V ±5% 0603 (1608 Metric) Thickness 1mm SMD; Tolerance: Â±5%; Case-EIA: 0603; Case-Metric: 1608; Max Thickness: 1 mm; Rated Voltage: 16 V; Value: 18pF; Technology: SMT
R25 = CMP-1012-00623-3: as R22 on sheet MAIN; Tolerance: 1%; Case Code (Imperial): 0603; Case Code (Metric): 1608; Composition: ThickFilm; Contact Plating: Tin; Datasheet URL: https://industrial.panasonic.com/cdbs/www-data/pdf/RDA0000/AOA0000C304.pdf; Datasheet Version: 02/2017; Depth: 0.8mm; Height: 0.45mm; Lead Free: LeadFree; Length: 1.6mm; Manufacturer URL: http://www.panasonic.com/; Max Operating Temperature: 155degC; Military Standard: Not; Min Operating Temperature: -55degC; Mount: SurfaceMount; Mounting Technology: SurfaceMount; Number of Pins: 2; Number of Terminations: 2; Package Description: 2-Pin Surface Mount Device, Body 1.6 x 0.85 mm; Package Quantity: 1; Package Reference: 603; Packaging: TapeandReel; Power Rating: 100mW; Radiation Hardening: No; REACH SVHC: NoSVHC; RoHSCompliant: true; Termination: SMD/SMT; Voltage Rating: 75V; Width: 0.031inch
R26 = CMP-1012-00397-1: as R23 on sheet MAIN; Technology: SMT; Tolerance: 1 %; Power: 0.1 W
SW2 = CMP-10040-000011-1: as SW1 on sheet MAIN; Voltage Rating Dc: 16V; Device Class L2: Switches; Device Class L1: Electromechanical; ComponentLink2URL: https://www.ckswitches.com/media/1476/pts810.pdf; Digikey Description: SWITCH TACTILE SPST-NO 0.05A 16V; RoHS: TRUE; Temperature Range Low: -40°C; Temperature Range High: +85°C; Automotive: No; Category: Switch; ComponentLink2Description: Datasheet; Device Class L3: Tactile Switches; Mouser Description: Switch Tactile N.O. SPST Button J-Bend 0.05A 16VDC 100000Cycles 3.92N SMD T/R; Throw Configuration: SPST-NO; Package: PTS810 SJG 250 SMTR LFS; Height: 2.7mm; Octopart: https://octopart.com/pts810sjg250smtrlfs-c%26k+components-29380277; Manufacturer Part Number: PTS810 SJG 250 SMTR LFS; Temperature: -40°C to +85°C; Lead Free: Yes
TP13-TP17 TP24 TP25 = 0.1" Pad-A.4
U2 = 20021111-00010T4LF: CONN HEADER 10POS UNSHD VERT T/H; Manufacturer: Amphenol / FCI; Stack Height: 2.5 mm; Number of Positions / Contacts: 10; Brand: FCI; Pitch: 1.27 mm; Mounting Angle: Vertical; Current Rating: 10 A; Mating Post Length: 3.05 mm; Voltage Rating: 125 V; Manufacturer Part Number: 20021111-00010T4LF; Mounting Style: Through Hole; Product Category: Headers & Wire Housings; RoHS: Details; Series: Minitek; Product Type: Headers; Type: Unshrouded; Number of Positions: 10; Number of Rows: 2; Contact Plating: Gold; Housing Material: Plastic; Termination Style: Through Hole; Contact Material: Nickel; Packaging: Tube; Factory Pack Quantity: 93; Termination Post Length: 2.3 mm; ComponentLink1URL: https://datasheet.ciiva.com/1433/1079612-1433267.pdf; ComponentLink1Description: https://datasheet.ciiva.com/1433/1079612-1433267.pdf; ComponentLink2URL: https://datasheet.ciiva.com/409/20021111-409158.pdf; ComponentLink2Description: https://datasheet.ciiva.com/409/20021111-409158.pdf; ComponentLink3URL: https://datasheet.ciiva.com/5131/20021111-5131386.pdf; ComponentLink3Description: https://datasheet.ciiva.com/5131/20021111-5131386.pdf; ComponentLink4URL: https://datasheet.ciiva.com/9465/20021111-9465402.pdf; ComponentLink4Description: https://datasheet.ciiva.com/9465/20021111-9465402.pdf; Supplier 1: Digi-Key
U3 = SAMW25H18-MR510PB: RF TXRX MODULE WIFI TRACE ANT; Manufacturer: Atmel; Manufacturer Part Number: ATSAMW25H18-MR510PB; Protocol: 802.11b/g/n; Frequency: 2.4GHz; Data Rate: 65Mbps; Power - Output: 17dBm; Sensitivity: -95.5dBm; Serial Interfaces: SPI, UART; Antenna Type: Integrated, Trace; Memory Size: 256kB Flash, 32kB SRAM; Voltage - Supply: 2.7 V ~ 4.2 V; Category: RF/IF and RFID; Family: RF Transceiver Modules; Series: Xplained Pro; Packaging: Tray; RF Family/Standard: WiFi; Modulation: -; Current - Receiving: -; Current - Transmitting: -; Mounting Type: Surface Mount; Operating Temperature: -40°C ~ 85°C; Package / Case: Module; ComponentLink1URL: http://www.atmel.com/devices/ATSAMW25.aspx; ComponentLink1Description: http://www.atmel.com/devices/ATSAMW25.aspx; ComponentLink2URL: http://www.farnell.com/datasheets/1965115.pdf; ComponentLink2Description: http://www.farnell.com/datasheets/1965115.pdf; Supplier 1: Digikey; Stock 1: 120; Pricing 1: 1=19.14 (USD); Supplier Part Number 1: ATSAMW25H18-MR510PB-ND
X1 = CMP-0447-00001-2: Crystal, 32.768 kHz, 12.5 pF, -40 to 85 degC, SMD Low Profile 3.2 x 1.5 x 0.9 mm, Tape and Reel; Manufacturer: Abracon; Q Value (Type): 30000; Operation Mode: Flexural Mode (Tuning Fork); Shunt Capacitance (C0): 0.9 to 1.2 pF; Load Capacitance (CL): 12.5 pF; Frequency Tolerance @+25degC: +/- 20 ppm; Drive Level (Type): 0.1 uW; Equivalent Series Resistance (R1): 70 Kohm; Insulation Resistance (Min): 500 Mohm; ComponentLink3URL: http://www.abracon.com/Resonators/ABS07.pdf; PackageDescription: 2-Pin Hand Drawn, Body 3.2x1.5mm, Pitch 2.5mm; Operating Temperature: -40 to 85 degC; ComponentLink2URL: http://www.abracon.com/Resonators/ABS07.pdf; PackageReference: ABS07-2; ComponentLink3Description: Package Specification; ComponentLink1Description: Manufacturer URL; DatasheetVersion: 04.03.13; Mounting Technology: Surface Mount; ComponentLink2Description: Datasheet; ComponentLink1URL: http://www.abracon.com/; PartNumber: ABS07-32.768KHz-T; Packing: Tape and Reel; Frequency: 32.768 kHz

## Sheet Memory.SchDoc: Memory
size 431 x 279 mm; ApprovedBy: Wuji Zhang; CheckedBy: Wuji Zhang; Author: Wuji Zhang; CompanyName: Upenn; DrawnBy: Wuji Zhang; Engineer: Wuji Zhang; Organization: Upenn; Address1: ADDRESS 1; Address2: ADDRESS 2; Address3: ADDRESS 3; Address4: ADDRESS 4; Revision: -; SheetNumber: 6; SheetTotal: 9; ENG_APP_DATE: --/--/--; DSN_APP_DATE: --/--/--; CHK_APP_DATE: --/--/--
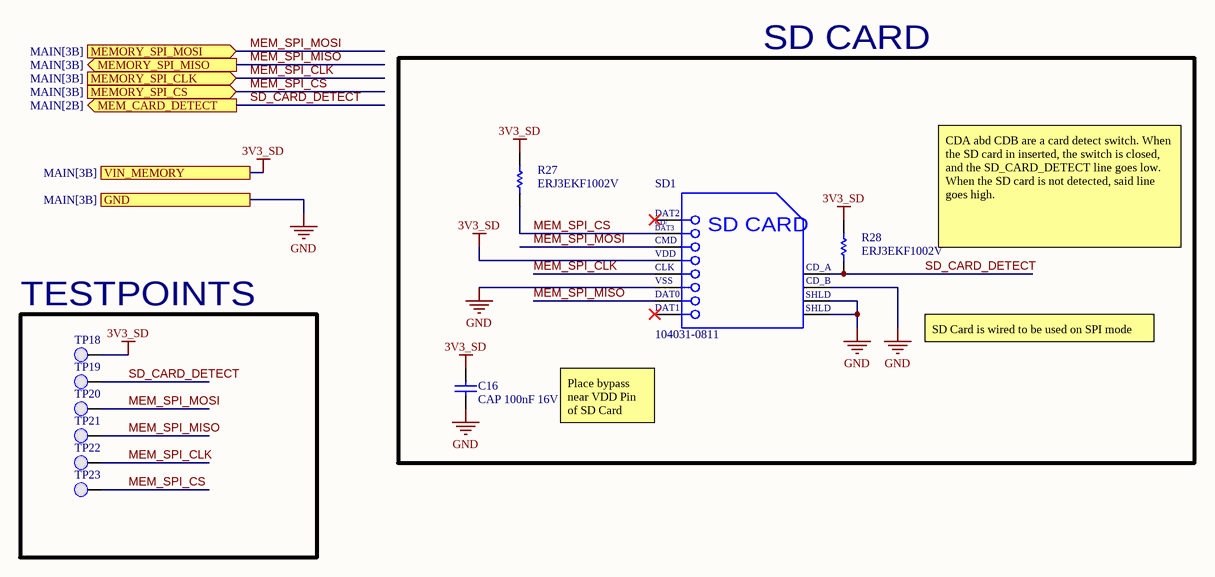
[diagram p3: Memory.SchDoc]

### Parts
(Parts that share a designator on the sheet are numbered #1, #2 ... from top to bottom, then left to right.)
C16  CAP 100nF 16V 0603(1608)  [CAPC0603(1608)100_N]
R27  ERJ3EKF1002V  [RESC1609X55X30LL15T15]
R28#1  ERJ3EKF1002V  [RESC1609X55X30LL15T15]
SD1  104031-0811  [MOLX-104031-0811_V]
TP18  0.1" Pad  [PCBComponent]  (value not drawn)
TP19  0.1" Pad  [PCBComponent]  (value not drawn)
TP20  0.1" Pad  [PCBComponent]  (value not drawn)
TP21  0.1" Pad  [PCBComponent]  (value not drawn)
TP22  0.1" Pad  [PCBComponent]  (value not drawn)
TP23  0.1" Pad  [PCBComponent]  (value not drawn)

### Blocks framed on the sheet
SD CARD: C16 R27 R28#1 SD1
TESTPOINTS: TP18-TP23

### Ports
GND (see MAIN[3B]), MEM_CARD_DETECT (out, see MAIN[2B]), MEMORY_SPI_CLK (in, see MAIN[3B]), MEMORY_SPI_CS (in, see MAIN[3B]), MEMORY_SPI_MISO (out, see MAIN[3B]), MEMORY_SPI_MOSI (in, see MAIN[3B]), VIN_MEMORY (see MAIN[3B])

### Nets
3V3_SD: C16.2 R27.2 R28#1.2 SD1.4(VDD) TP18.1(PAD) ; port VIN_MEMORY  [project net 3V3]
GND: C16.1 SD1.6(VSS2) SD1.10(CD_B) SD1.11(SHLD1) SD1.12(SHLD2) ; port GND
MEM_SPI_CLK: SD1.5(CLK) TP22.1(PAD) ; port MEMORY_SPI_CLK
MEM_SPI_CS: R27.1 SD1.2(CMD) TP23.1(PAD) ; port MEMORY_SPI_CS  [project net FLASH_MEM_SPI_SS]
MEM_SPI_MISO: SD1.7(DAT0) TP21.1(PAD) ; port MEMORY_SPI_MISO
MEM_SPI_MOSI: SD1.3(VSS1) TP20.1(PAD) ; port MEMORY_SPI_MOSI
SD_CARD_DETECT: R28#1.1 SD1.9(CD_A) TP19.1(PAD) ; port MEM_CARD_DETECT

Not connected (* = marked no-connect by the designer): SD1 1(CD/DAT3)* 8(DAT1)*

### Notes on the sheet
- CDA abd CDB are a card detect switch. When the SD card in inserted, the switch is closed, and the SD_CARD_DETECT line goes low. When the SD card is not detected, said line goes high.
- SD Card is wired to be used on SPI mode
- Place bypass near VDD Pin of SD Card
- DWG. NO.
- REV.
- SHT.
- THIS DOCUMENT AND THE DATA DISCLOSED HEREIN OR HEREWITH IS THE PROPERTY OF ALTIUM LIMITED AND MAY BE FREELY DISTRIBUTED IN WHOLE. NO RIGHTS ARE RESERVED OR EXPRESS OR IMPLIED WARANTEE GIVEN.
- REVISION
- DESCRIPTION
- DATE
- APPROVED
- ENG:
- APPROVALS
- PROJECT
- DSN:
- CHK:
- REFERENCE DOCUMENTS
- PROJECT REVISION:
- TITLE
- DOCUMENT REVISION:
- DESIGN ITEM:
- BOM:
- FAB DWG:
- PCB DWG:
- ASSY DWG:
- SCALE:
- SIZE
- B
- CAGE CODE
- FILE NAME
- DWG NO.
- SHEET
- OF
- REV
- (in symbol CMP-2000-05825-1) DAT2; CD/; DAT3; SD CARD; VSS; SHLD

### Library data of the parts
C16 = CMP-1035-02584-1: as C1 on sheet FTDI; Technology: SMT; Max Thickness: 1 mm; Value: 100nF; Rated Voltage: 16 V
R27 R28#1 = CMP-1012-00623-3: as R22 on sheet MAIN; Tolerance: 1%; Case Code (Imperial): 0603; Case Code (Metric): 1608; Composition: ThickFilm; Contact Plating: Tin; Datasheet URL: https://industrial.panasonic.com/cdbs/www-data/pdf/RDA0000/AOA0000C304.pdf; Datasheet Version: 02/2017; Depth: 0.8mm; Height: 0.45mm; Lead Free: LeadFree; Length: 1.6mm; Manufacturer URL: http://www.panasonic.com/; Max Operating Temperature: 155degC; Military Standard: Not; Min Operating Temperature: -55degC; Mount: SurfaceMount; Mounting Technology: SurfaceMount; Number of Pins: 2; Number of Terminations: 2; Package Description: 2-Pin Surface Mount Device, Body 1.6 x 0.85 mm; Package Quantity: 1; Package Reference: 603; Packaging: TapeandReel; Power Rating: 100mW; Radiation Hardening: No; REACH SVHC: NoSVHC; RoHSCompliant: true; Termination: SMD/SMT; Voltage Rating: 75V; Width: 0.031inch
SD1 = CMP-2000-05825-1: Micro SD Card, RA, -25 to 85 degC, 8-Pin SMD, RoHS, Tape and Reel; Voltage Rating: 10VAC/DC; Number of Contacts: 8; Insertion - Extraction Style: Push-Pull; Pitch: 1.1mm; Mating Cycles: 10000; Brand: Molex; Current Rating: 500mA; Manufacturer URL: http://www.molex.com/; Card Type: microSD; Mounting Type: Standard; Height: 1.42mm; Mounting Technology: SurfaceMount; Contact Plating: Gold; Product Category: MemoryCardConnectors; Package Description: 8-Pin Surface Mount Device, Body 11.95 x 11.4 mm, Pitch 1.1 mm; Datasheet URL: http://www.molex.com/pdm_docs/sd/1040310811_sd.pdf; Termination Style: SMD; Length: 11.4mm; Housing Material: LiquidCrystalPolymer(LCP); Orientation: RightAngle; RoHS: True; Contact Material: PhosphorBronze; Datasheet Version: Rev. E, 04/2006; Packaging: Reel; Manufacturer: Molex; Series: 104031; Product: CardConnectors; Number of Rows: 1Row; Package Reference: 104031-0811
TP18-TP23 = 0.1" Pad-A.4

## Sheet LiPo_Charger.SchDoc: LiPo Charger
size 431 x 279 mm; ApprovedBy: Wuji Zhang; CheckedBy: Wuji Zhang; Author: Wuji Zhang; CompanyName: Upenn; DrawnBy: Wuji Zhang; Engineer: Wuji Zhang; Organization: ORGANIZATION; Address1: ADDRESS 1; Address2: ADDRESS 2; Address3: ADDRESS 3; Address4: ADDRESS 4; Revision: -; SheetNumber: 7; SheetTotal: 8; ENG_APP_DATE: --/--/--; DSN_APP_DATE: --/--/--; CHK_APP_DATE: --/--/--
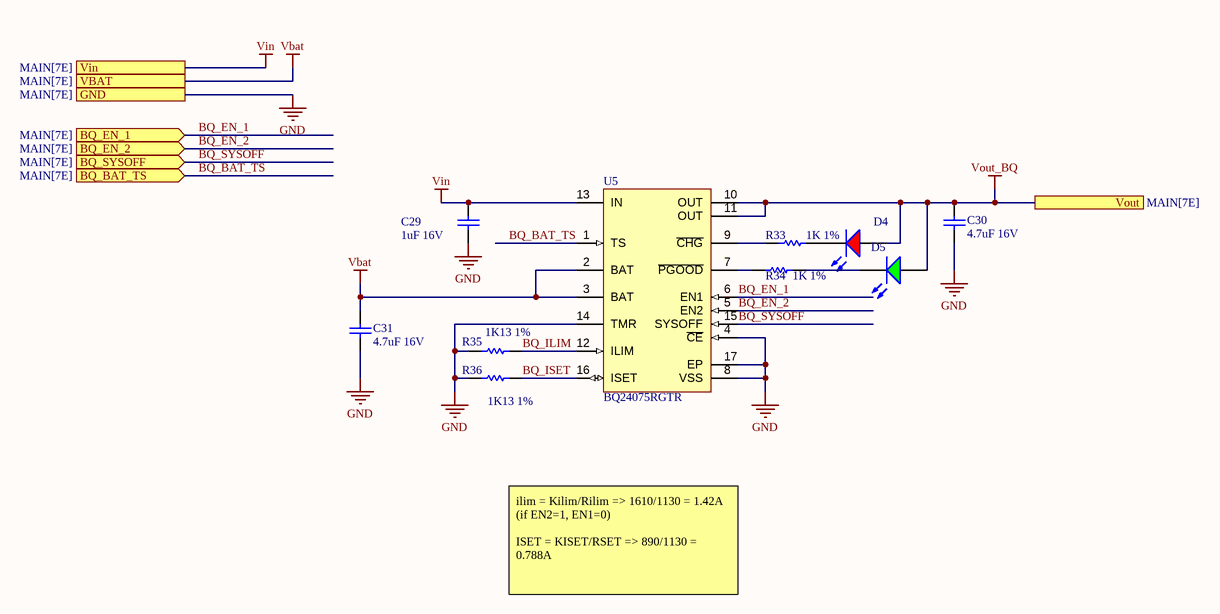
[diagram p4: LiPo_Charger.SchDoc]

### Parts
C29  1uF 16V  [CAPC0603(1608)100_N]
C30  4.7uF 16V  [CAPC0805(2012)145_N]
C31  4.7uF 16V  [CAPC0805(2012)145_N]
D4  LTST-C170CKT  [LTST-C170CKT_V]  (value not drawn)
D5  LTST-C170GKT  [LTST-C170GKT_V]  (value not drawn)
R33  1K 1%  [RESC0603(1608)_N]
R34  1K 1%  [RESC0603(1608)_N]
R35  1K13 1%  [RESC0603(1608)_N]
R36  1K13 1%  [RESC0603(1608)_N]
U5  BQ24075RGTR  [RGT0016C_V]

### Ports
BQ_BAT_TS (in, see MAIN[7E]), BQ_EN_1 (in, see MAIN[7E]), BQ_EN_2 (in, see MAIN[7E]), BQ_SYSOFF (in, see MAIN[7E]), GND (see MAIN[7E]), VBAT (see MAIN[7E]), Vin (see MAIN[7E]), Vout (see MAIN[7E])

### Nets
GND: C29.1 C30.1 C31.2 R35.1 R36.1 U5.4(~{CE}) U5.5(EN2) U5.8(VSS) U5.14(TMR) U5.15(SYSOFF) U5.17(EP) ; port BQ_EN_2, port BQ_SYSOFF, port GND  [also labelled BQ_EN_2, BQ_SYSOFF]
VBAT: C31.1 U5.2(BAT) U5.3(BAT) ; port VBAT
Vin: C29.2 U5.13(IN) ; port Vin  [project net VUSB]
Vout_BQ: C30.2 D4.1(A) D5.1(A) U5.6(EN1) U5.10(OUT) U5.11(OUT) ; port BQ_EN_1, port Vout  [also labelled BQ_EN_1]
BQ_BAT_TS: U5.1(TS) ; port BQ_BAT_TS
BQ_ILIM: R35.2 U5.12(ILIM)  [project net BQ_ILIM_7]
BQ_ISET: R36.2 U5.16(ISET)  [project net BQ_ISET_7]
NetD4_2: D4.2(K) R33.2
NetD5_2: D5.2(K) R34.2
NetR33_1: R33.1 U5.9(~{CHG})
NetR34_1: R34.1 U5.7(~{PGOOD})

### Notes on the sheet
- ilim = Kilim/Rilim => 1610/1130 = 1.42A (if EN2=1, EN1=0)
  ISET = KISET/RSET => 890/1130 = 0.788A
- DWG. NO.
- REV.
- SHT.
- THIS DOCUMENT AND THE DATA DISCLOSED HEREIN OR HEREWITH IS THE PROPERTY OF ALTIUM LIMITED AND MAY BE FREELY DISTRIBUTED IN WHOLE. NO RIGHTS ARE RESERVED OR EXPRESS OR IMPLIED WARANTEE GIVEN.
- REVISION
- DESCRIPTION
- DATE
- APPROVED
- ENG:
- APPROVALS
- PROJECT
- DSN:
- CHK:
- REFERENCE DOCUMENTS
- PROJECT REVISION:
- TITLE
- DOCUMENT REVISION:
- DESIGN ITEM:
- BOM:
- FAB DWG:
- PCB DWG:
- ASSY DWG:
- SCALE:
- SIZE
- B
- CAGE CODE
- FILE NAME
- DWG NO.
- SHEET
- OF
- REV

### Library data of the parts
C29 = CMP-1035-02736-1: as C10 on sheet MAIN; Technology: SMT; Max Thickness: 1 mm; Rated Voltage: 16 V; Value: 1uF
C30 C31 = CMP-1036-04893-1: as C4 on sheet FTDI; Max Thickness: 1.45 mm; Value: 4.7uF; Rated Voltage: 16 V; Tolerance: -20% to +80%; Technology: SMT
D4 = CMP-1674-00001-5: as D1 on sheet FTDI; PackageReference: C170CKT; ComponentLink1Description: Manufacturer URL; ComponentLink1URL: http://www.us.liteon.com/; Package Quantity: 3000; Packaging: Tape and Reel; Pins: 2; ComponentLink2URL: http://media.digikey.com/pdf/Data%20Sheets/Lite-On%20PDFs/LTST-C170CKT.pdf; Max Operating Temperature: 85 degC; Min Operating Temperature: -55 degC; Mounting Technology: Surface Mount; Mount: Surface Mount; Length: 2 mm; ComponentLink2Description: Datasheet; DatasheetVersion: 03/2003; Height: 1.1 mm; PackageDescription: 2-Pin Surface Mount Device, Body 2 x 1.25 mm; RoHSCompliant: true; Colour: Red
D5 = CMP-1674-00002-5: LED Uni-Color Green, 100 mW, 120 mA, -55 to 85 degC, 2-Pin SMD, RoHS, Tape and Reel; Manufacturer: Lite-On; PackageReference: C170GKT; ComponentLink1Description: Manufacturer URL; ComponentLink1URL: http://www.us.liteon.com/; Height: 1.1 mm; PackageDescription: 2-Pin Surface Mount Device, Body 2 x 1.25 mm; RoHSCompliant: true; Package Quantity: 1; Packaging: Tape and Reel; Mount: Surface Mount; Min Operating Temperature: -55 degC; DatasheetVersion: 03/2003; Max Operating Temperature: 85 degC; Pins: 2; Mounting Technology: Surface Mount; Length: 2 mm; Colour: Green; ComponentLink2URL: http://media.digikey.com/pdf/Data%20Sheets/Lite-On%20PDFs/LTST-C170GKT.pdf; ComponentLink2Description: Datasheet
R33 R34 = CMP-1012-00510-1: as R9 on sheet MAIN; Technology: SMT; Tolerance: 1 %; Power: 0.1 W
R35 R36 = CMP-1012-00515-1: 1K13 0.1W 1% 0603 (1608 Metric)  SMD; Value: 1130.00 Ohm; Case-EIA: 0603; Case-Metric: 1608; Power: 0.1 W; Tolerance: 1 %; Technology: SMT
U5 = CMP-0321-00238-2: USB-Friendly Li-Ion Battery Charger and Power-Path Management IC, Vout 5.5 V, 4.3 V, -40 to 85 degC, 16-pin QFN (RGT), Green (RoHS & no Sb/Br); Manufacturer: Texas Instruments; SubFamily: Battery Charge Management; NiCd: N; Vin(Min)(V): 4.3; Mounting Technology: Surface Mount; PackageDescription: 16-Pin Plastic Quad Flat No-Lead, 3 x 3 mm Body, 0.5 mm Pitch, 1.7 x 1.7 mm Exposed Pad; Over Voltage Protection: N; Code_JEDEC: MO-220; Li-Ion: N; Eco-Plan: Green (RoHS & no Sb/Br); DatasheetVersion: SLUS810G; PackageVersion: revH, Oct-2011; PartNumber: BQ24075RGTR; PackageReference: RGT0016C; ComponentLink1URL: http://www.ti.com/general/docs/lit/getliterature.tsp?genericPartNumber=BQ24075&fileType=pdf; Lead Acid: N; ComponentLink1Description: Datasheet; Li-Polymer: N; NiMH: N